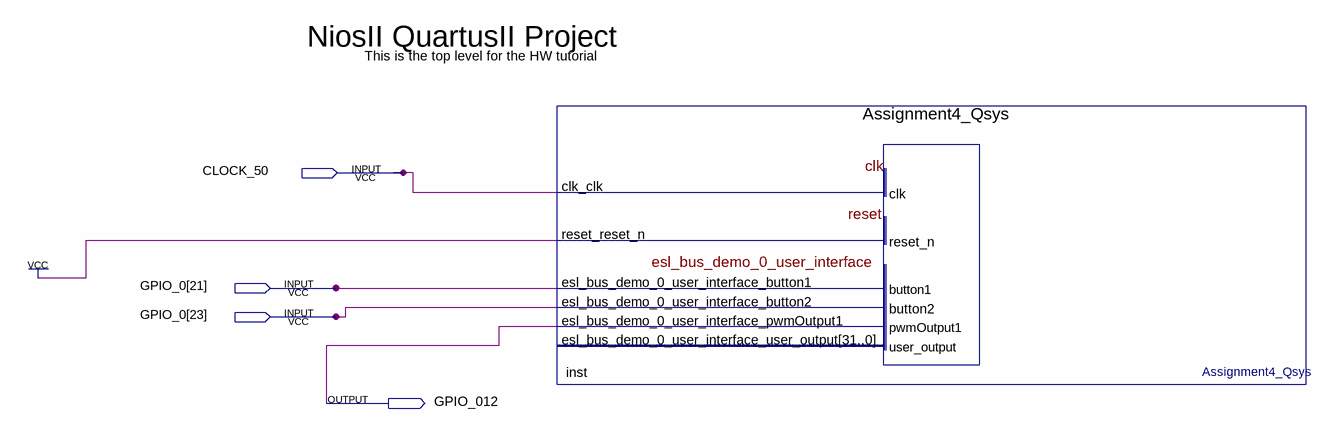
[diagram p0: schematic sheet]
// Quartus schematic nios2_quartus2_project.bdf as structural Verilog: 1 symbols, 4 pins
module nios2_quartus2_project (
  input  CLOCK_50,
  input  [23:21] GPIO_0,
  output GPIO_012
);

  Assignment4_Qsys inst (
    .clk_clk(CLOCK_50), .reset_reset_n(1'b1), .esl_bus_demo_0_user_interface_button1(GPIO_0[21]),
    .esl_bus_demo_0_user_interface_button2(GPIO_0[23]), .esl_bus_demo_0_user_interface_pwmOutput1(GPIO_012));  // open: esl_bus_demo_0_user_interface_user_output

  // Notes on the sheet:
  //   NiosII QuartusII Project
  //   This is the top level for the HW tutorial
endmodule
